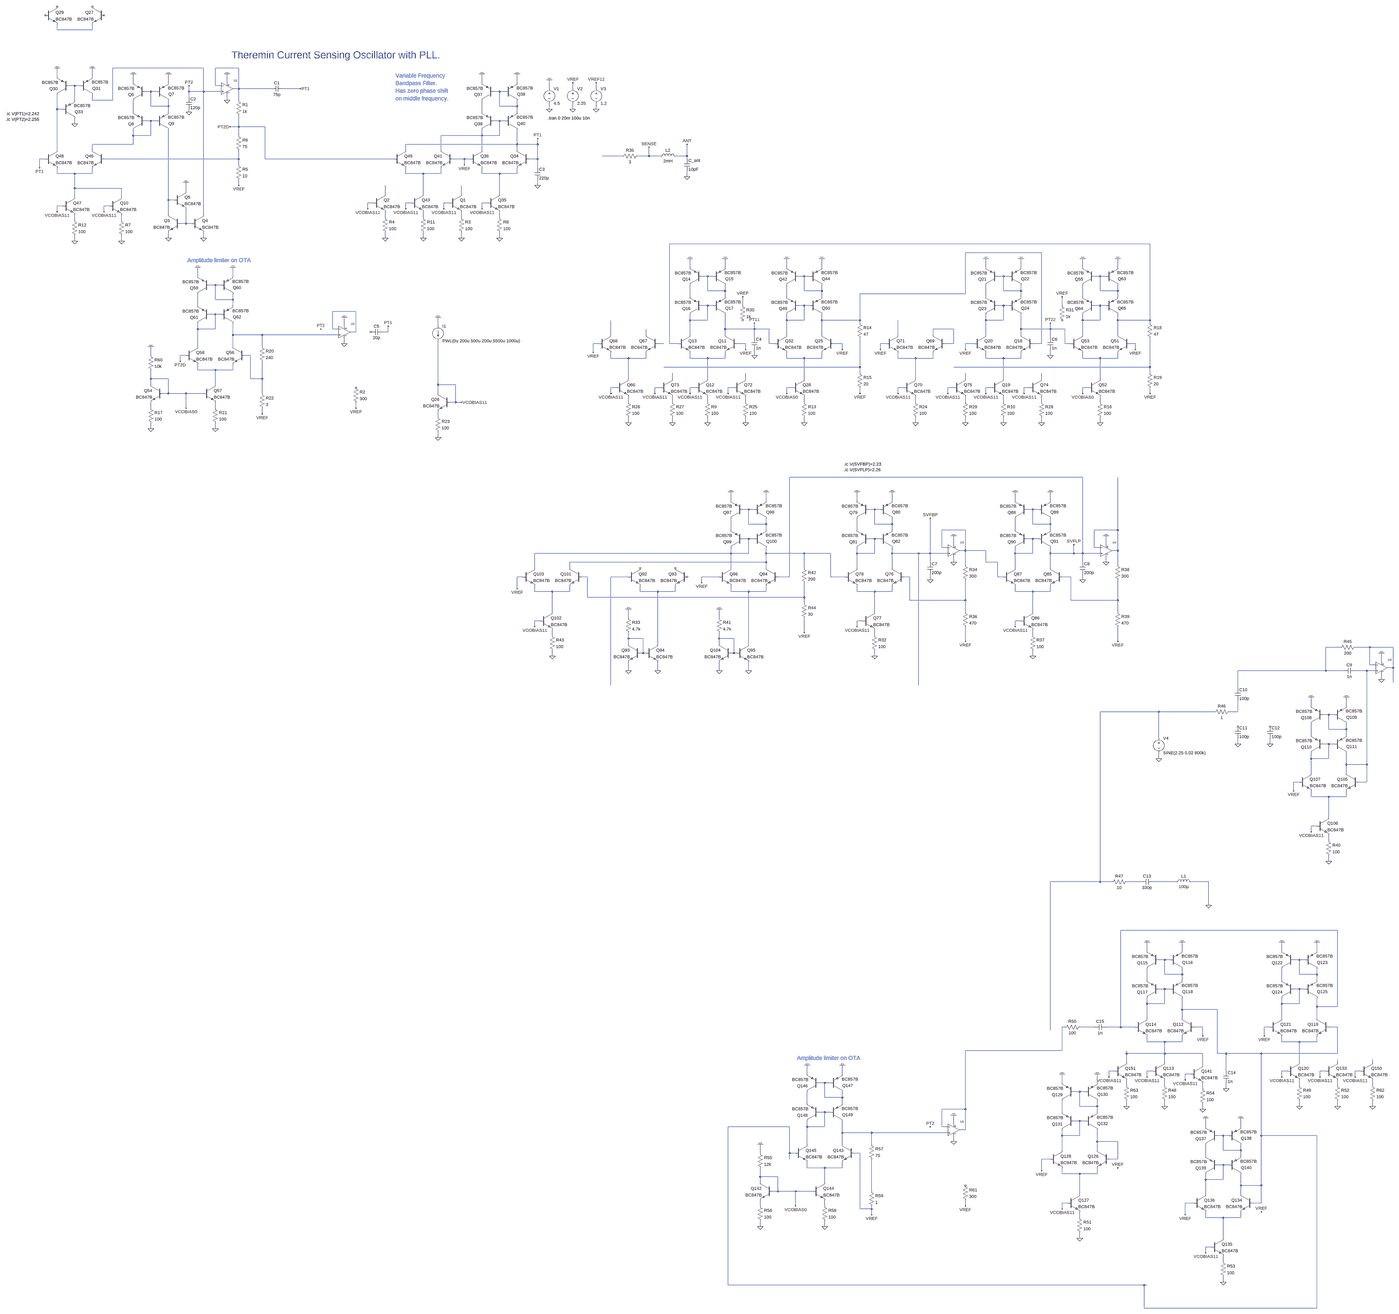
[diagram p0: schematic vco_and_lc_drive_v07.asc, whole sheet]
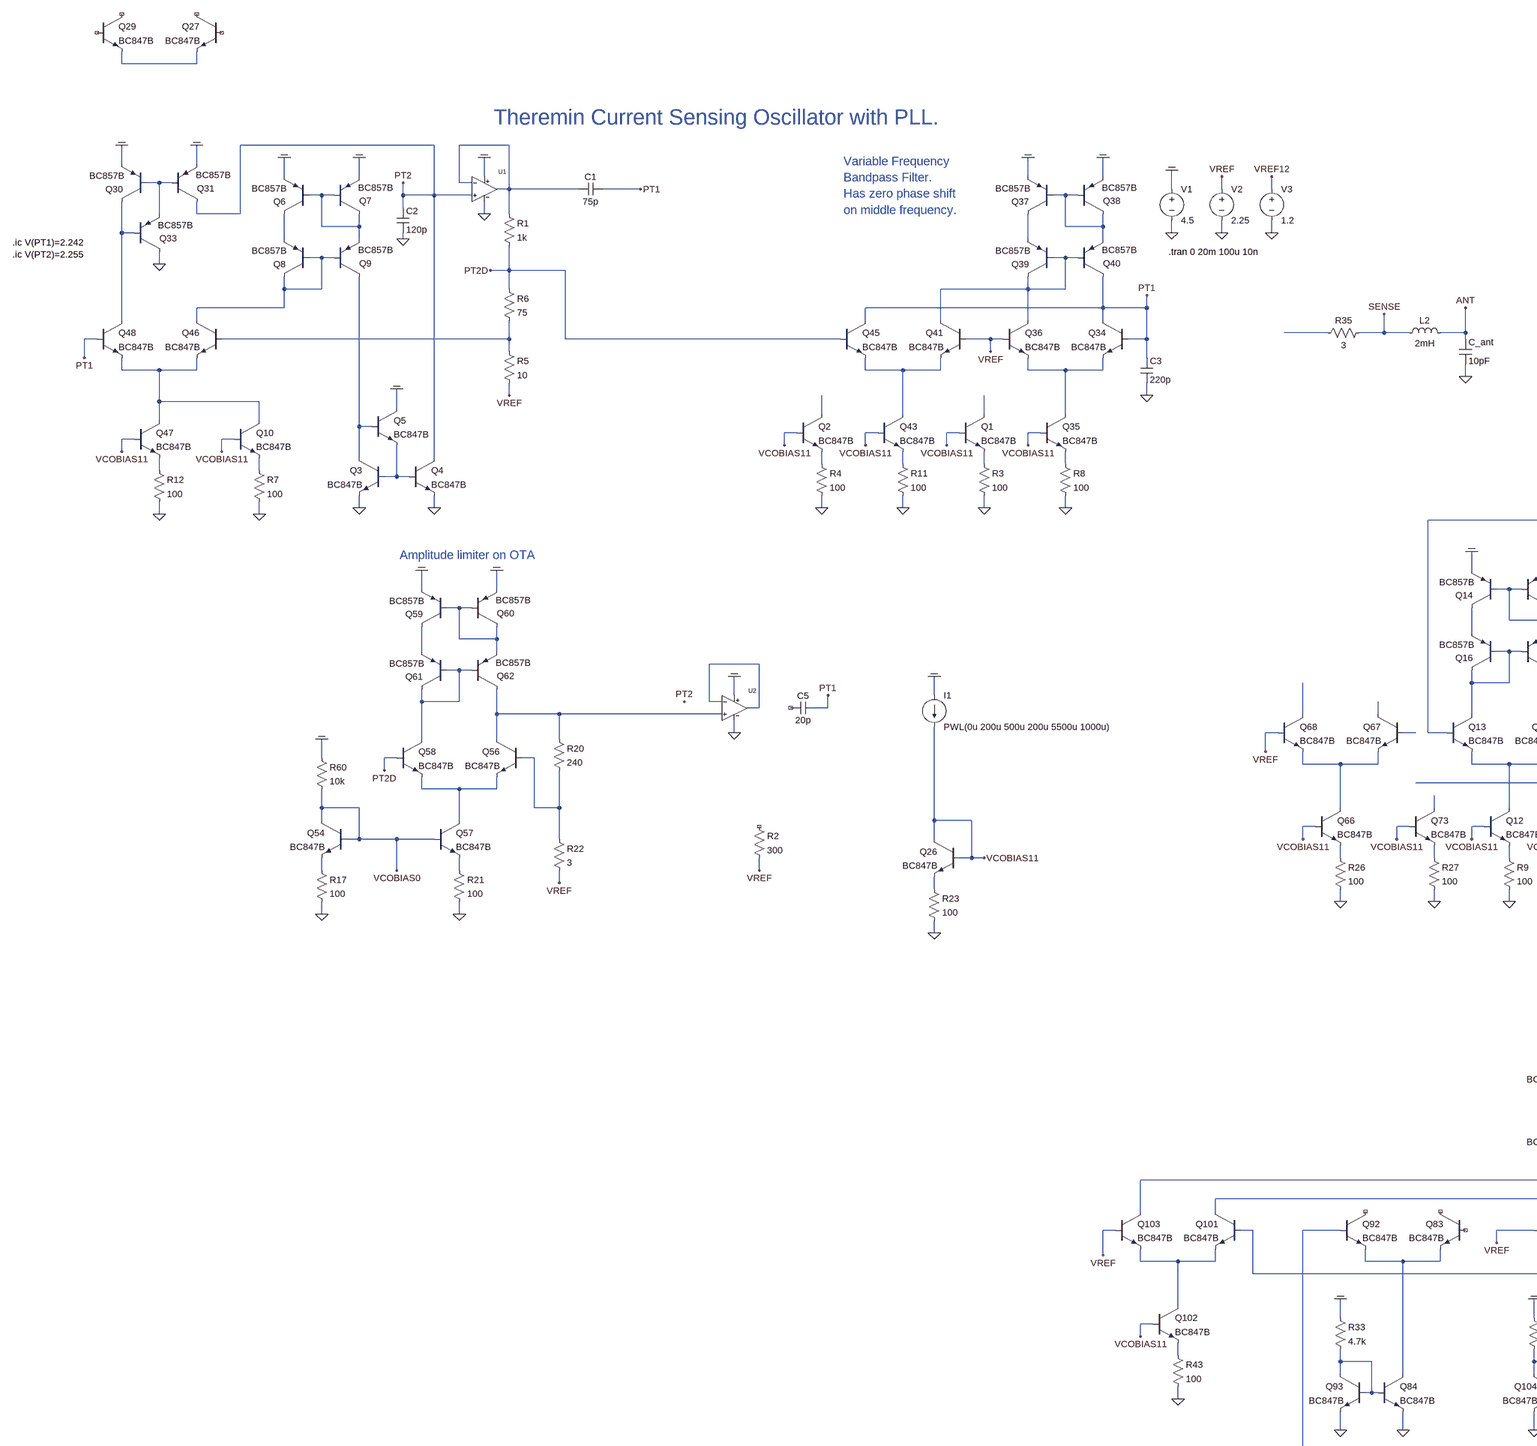
[diagram p1: schematic vco_and_lc_drive_v07.asc, part, row 1 of 2, column 1 of 2]
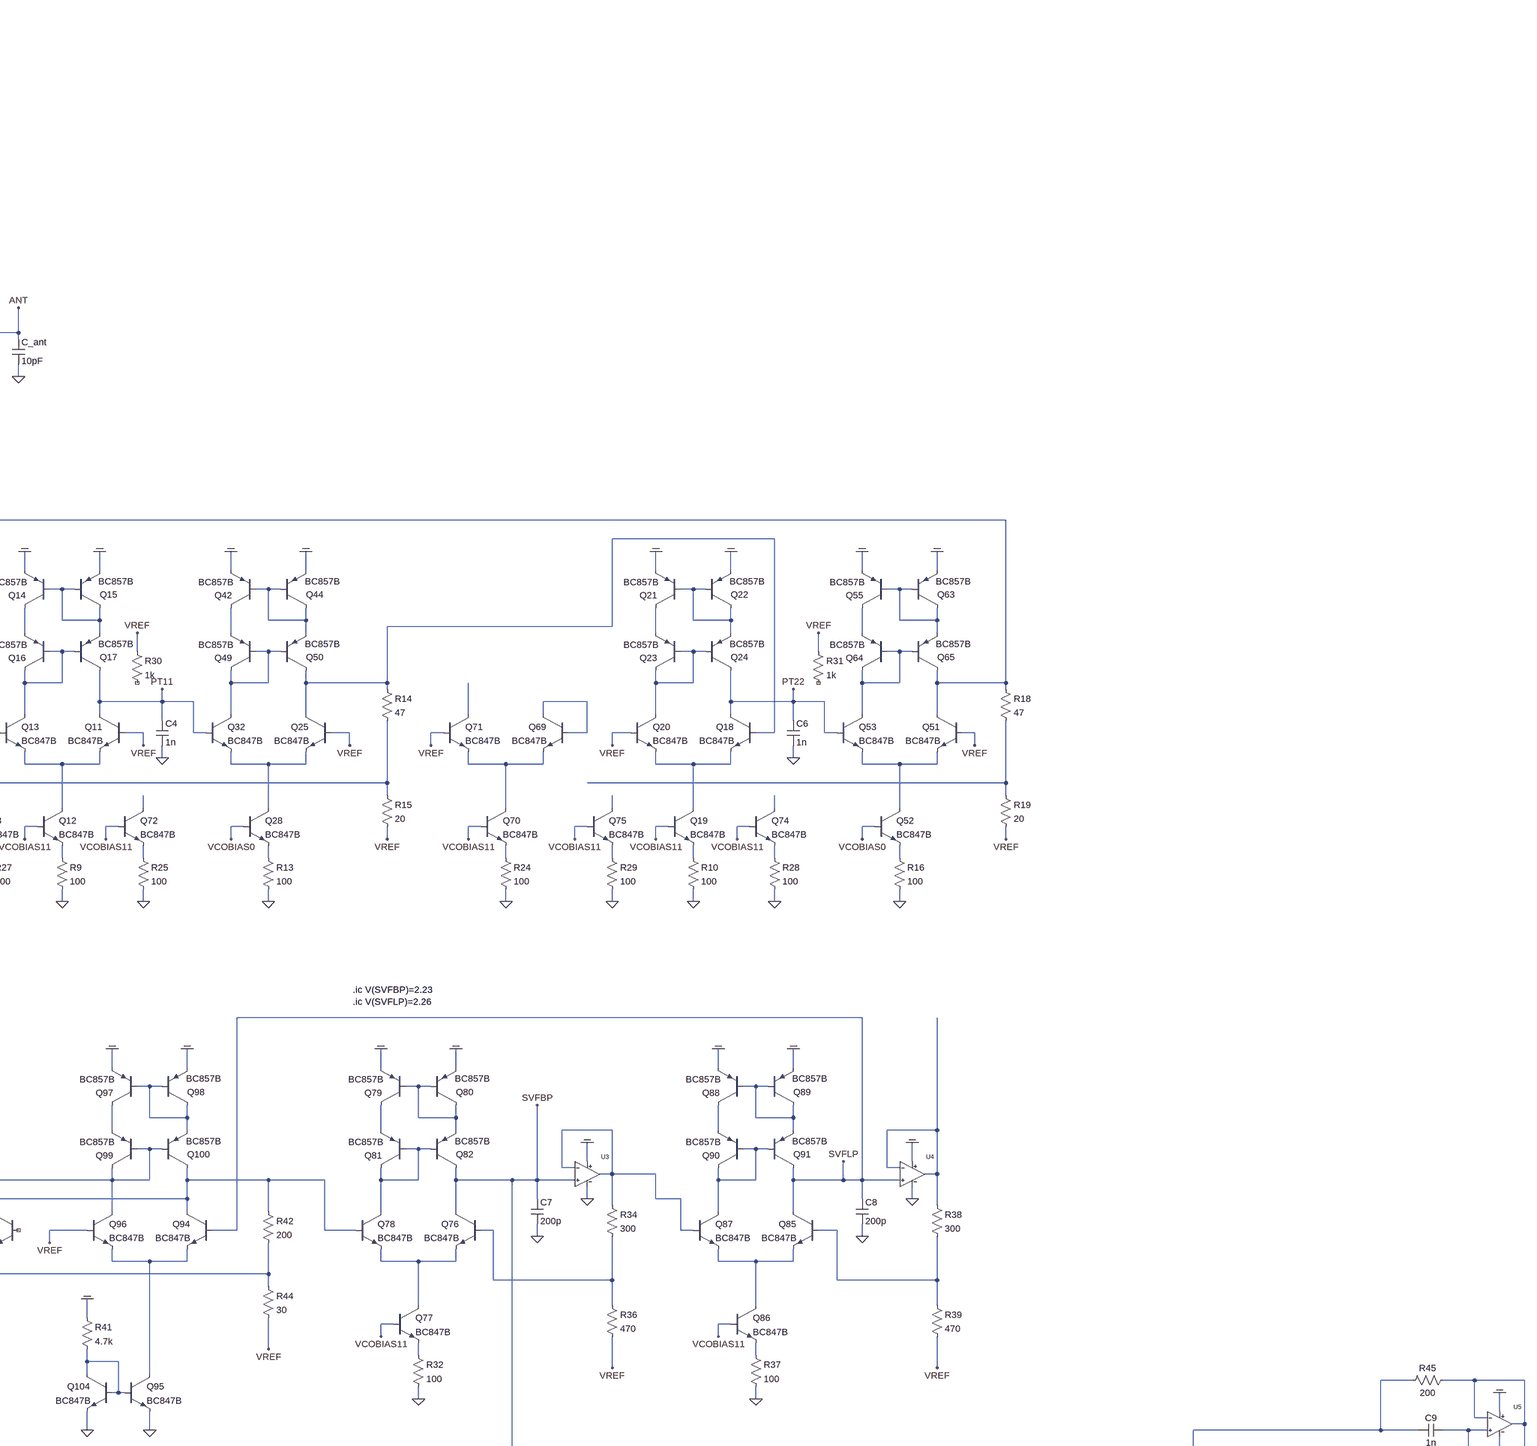
[diagram p2: schematic vco_and_lc_drive_v07.asc, part, row 1 of 2, column 2 of 2]
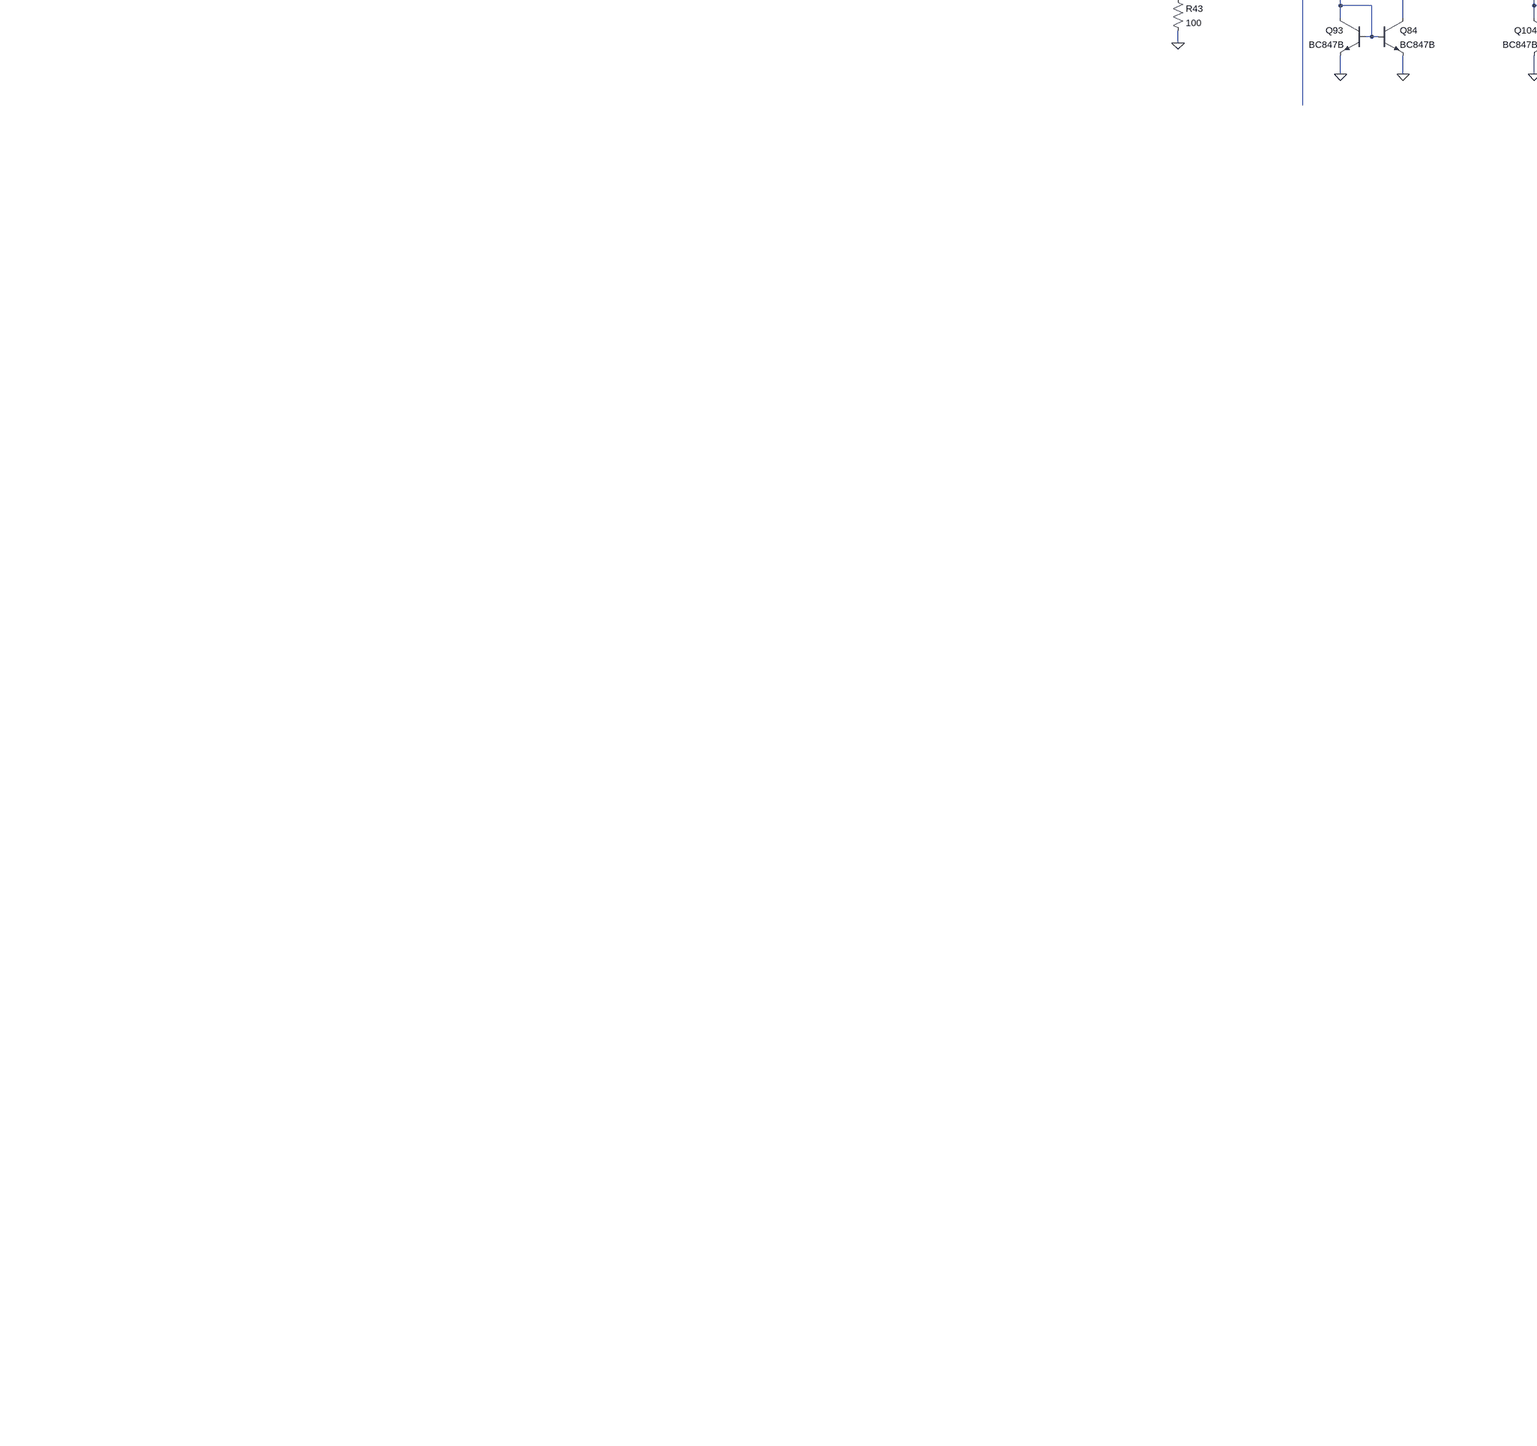
[diagram p3: schematic vco_and_lc_drive_v07.asc, part, row 2 of 2, column 1 of 2]
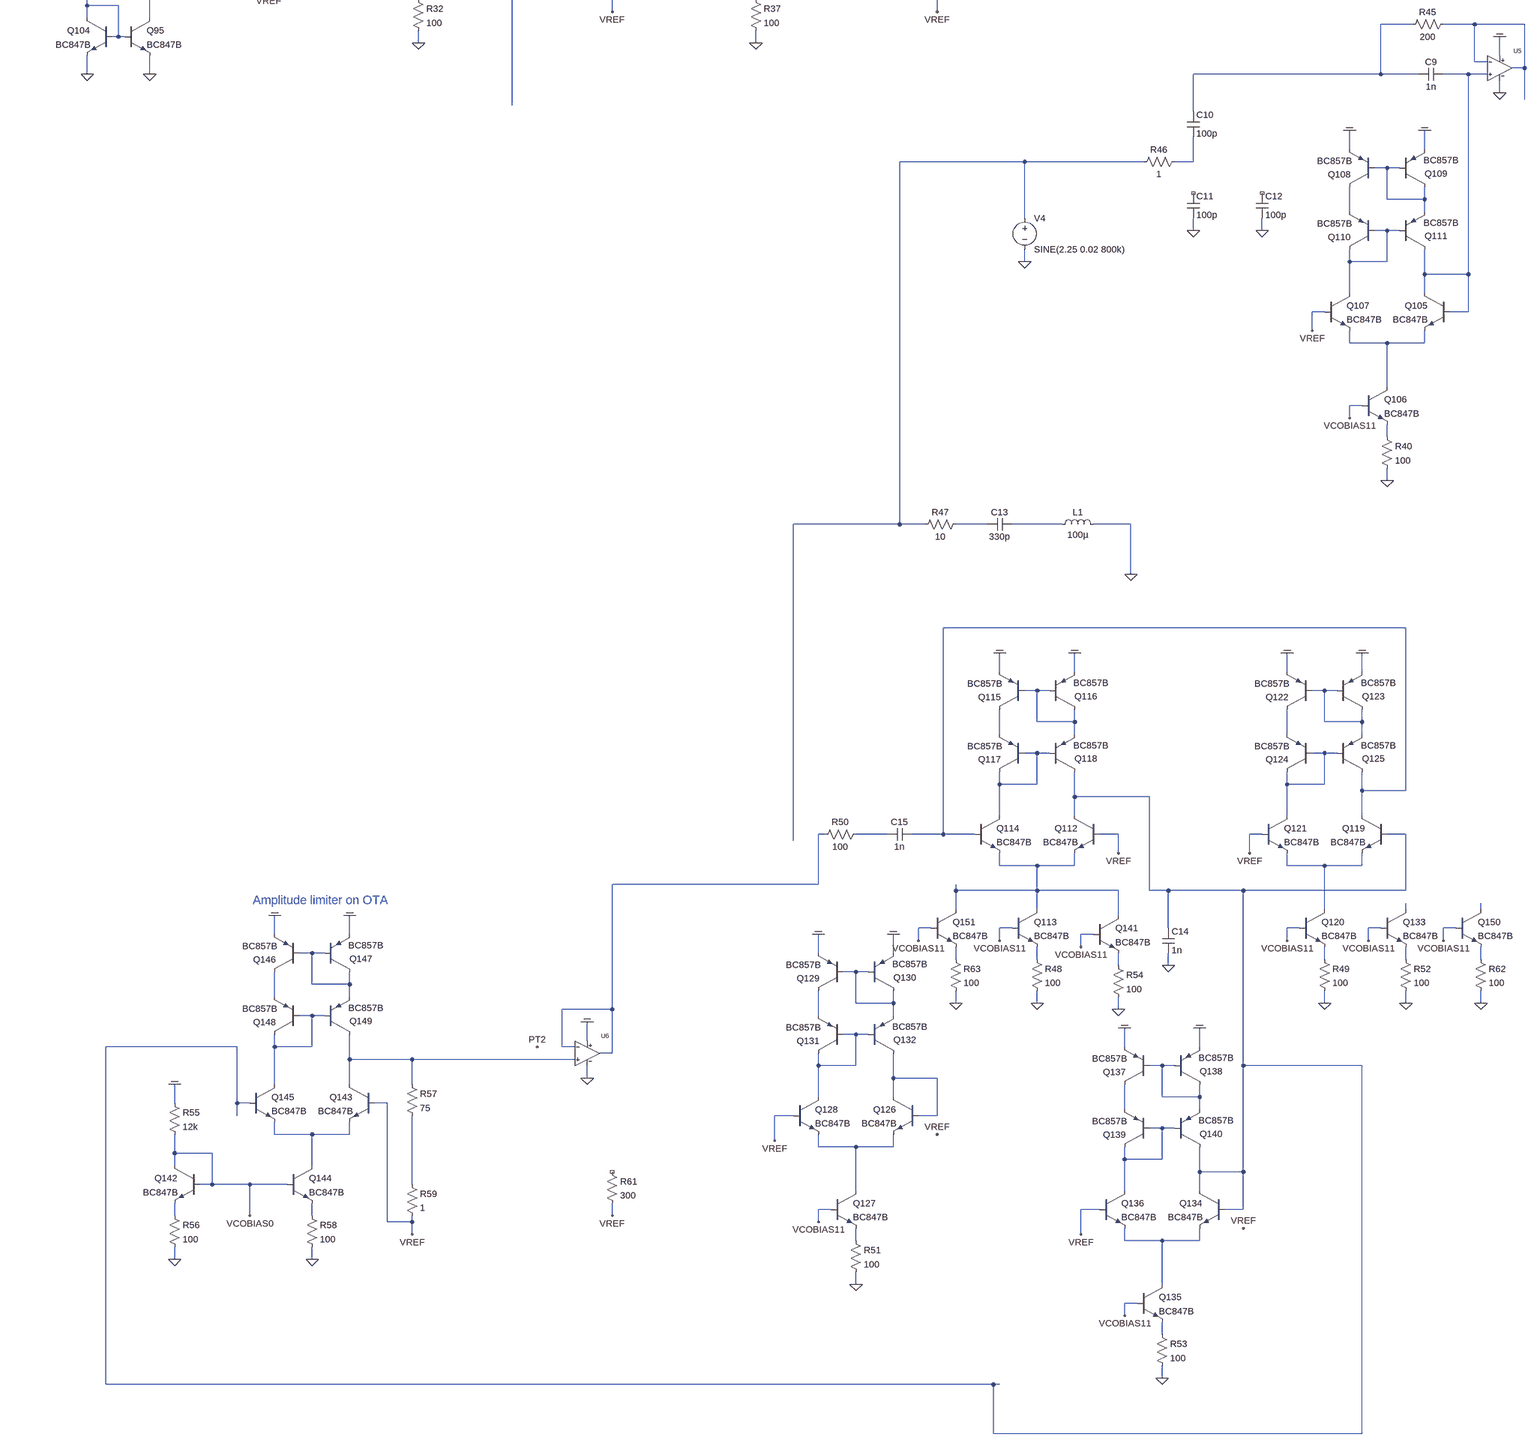
[diagram p4: schematic vco_and_lc_drive_v07.asc, part, row 2 of 2, column 2 of 2]
* vco_and_lc_drive_v07.asc
V1 COM 0 4.5
V2 VREF 0 2.25
R60 COM VCOBIAS0 10k
Q54 VCOBIAS0 VCOBIAS0 N074 0 BC847B
R17 N074 0 100
Q27 NC_01 NC_02 N001 0 BC847B
Q29 NC_03 NC_04 N001 0 BC847B
Q30 N006 N003 COM 0 BC857B
Q31 PT2 N003 COM 0 BC857B
Q33 0 N006 N003 0 BC857B
Q34 PT1 PT1 N015 0 BC847B
Q35 N015 VCOBIAS11 N022 0 BC847B
Q36 N010 VREF N015 0 BC847B
R8 N022 0 100
Q37 N008 N005 COM 0 BC857B
Q38 N005 N005 COM 0 BC857B
Q39 N010 N010 N008 0 BC857B
Q40 PT1 N010 N005 0 BC857B
C2 PT2 0 120p
C5 PT1 NC_05 20p
Q41 N010 VREF N014 0 BC847B
Q43 N014 VCOBIAS11 N020 0 BC847B
Q45 PT1 PT2D N014 0 BC847B
R11 N020 0 100
Q46 N009 N012 N013 0 BC847B
Q47 N013 VCOBIAS11 N023 0 BC847B
Q48 N006 PT1 N013 0 BC847B
R12 N023 0 100
Q56 N045 N050 N059 0 BC847B
Q57 N059 VCOBIAS0 N075 0 BC847B
Q58 N043 PT2D N059 0 BC847B
R20 N045 N050 240
R21 N075 0 100
R22 N050 VREF 3
Q59 N037 N032 COM 0 BC857B
Q60 N032 N032 COM 0 BC857B
Q61 N043 N043 N037 0 BC857B
Q62 N045 N043 N032 0 BC857B
XU2 N045 N042 COM 0 N042 MCP6021  ; pins In+ In- V+ V- OUT
L2 SENSE ANT 2mH Rser=120 Cpar=1pF
C_ant ANT 0 10pF
R35 N011 SENSE 3
V3 VREF12 0 1.2
C3 PT1 0 220p
Q26 VCOBIAS11 VCOBIAS11 N076 0 BC847B
R23 N076 0 100
I1 COM VCOBIAS11 PWL(0u 200u 500u 200u 5500u 1000u)
R2 NC_06 VREF 300
Q1 N017 VCOBIAS11 N021 0 BC847B
R3 N021 0 100
Q2 N016 VCOBIAS11 N019 0 BC847B
R4 N019 0 100
XU1 PT2 N002 COM 0 N002 MCP6021  ; pins In+ In- V+ V- OUT
R1 N002 PT2D 1k
R5 N012 VREF 10
R6 PT2D N012 75
Q3 N018 N025 0 0 BC847B
Q4 PT2 N025 0 0 BC847B
Q5 COM N018 N025 0 BC847B
Q6 N007 N004 COM 0 BC857B
Q7 N004 N004 COM 0 BC857B
Q8 N009 N009 N007 0 BC857B
Q9 N018 N009 N004 0 BC857B
C1 PT1 N002 75p
Q10 N013 VCOBIAS11 N024 0 BC847B
R7 N024 0 100
Q11 PT11 VREF N052 0 BC847B
Q12 N052 VCOBIAS11 N066 0 BC847B
Q13 N038 N026 N052 0 BC847B
R9 N066 0 100
Q14 N033 N028 COM 0 BC857B
Q15 N028 N028 COM 0 BC857B
Q16 N038 N038 N033 0 BC857B
Q17 PT11 N038 N028 0 BC857B
C4 PT11 0 1n
Q25 N027 VREF N053 0 BC847B
Q28 N053 VCOBIAS0 N068 0 BC847B
Q32 N039 PT11 N053 0 BC847B
R13 N068 0 100
Q42 N034 N029 COM 0 BC857B
Q44 N029 N029 COM 0 BC857B
Q49 N039 N039 N034 0 BC857B
Q50 N027 N039 N029 0 BC857B
R14 N027 N057 47
R15 N057 VREF 20
Q18 PT22 N027 N055 0 BC847B
Q19 N055 VCOBIAS11 N071 0 BC847B
Q20 N040 VREF N055 0 BC847B
R10 N071 0 100
Q21 N035 N030 COM 0 BC857B
Q22 N030 N030 COM 0 BC857B
Q23 N040 N040 N035 0 BC857B
Q24 PT22 N040 N030 0 BC857B
C6 PT22 0 1n
Q51 N026 VREF N056 0 BC847B
Q52 N056 VCOBIAS0 N073 0 BC847B
Q53 N041 PT22 N056 0 BC847B
R16 N073 0 100
Q55 N036 N031 COM 0 BC857B
Q63 N031 N031 COM 0 BC857B
Q64 N041 N041 N036 0 BC857B
Q65 N026 N041 N031 0 BC857B
R18 N026 N058 47
R19 N058 VREF 20
Q66 N051 VCOBIAS11 N064 0 BC847B
R26 N064 0 100
Q67 N047 N049 N051 0 BC847B
Q68 N046 VREF N051 0 BC847B
Q69 N044 N044 N054 0 BC847B
Q70 N054 VCOBIAS11 N069 0 BC847B
Q71 N048 VREF N054 0 BC847B
R24 N069 0 100
Q72 N061 VCOBIAS11 N067 0 BC847B
R25 N067 0 100
Q73 N060 VCOBIAS11 N065 0 BC847B
R27 N065 0 100
Q74 N063 VCOBIAS11 N072 0 BC847B
R28 N072 0 100
Q75 N062 VCOBIAS11 N070 0 BC847B
R29 N070 0 100
R30 VREF NC_07 1k
R31 VREF NC_08 1k
Q76 SVFBP N091 N096 0 BC847B
Q77 N096 VCOBIAS11 N099 0 BC847B
Q78 N086 N088 N096 0 BC847B
R32 N099 0 100
Q79 N081 N078 COM 0 BC857B
Q80 N078 N078 COM 0 BC857B
Q81 N086 N086 N081 0 BC857B
Q82 SVFBP N086 N078 0 BC857B
C7 SVFBP 0 200p
Q85 SVFLP N092 N097 0 BC847B
Q86 N097 VCOBIAS11 N100 0 BC847B
Q87 N087 N082 N097 0 BC847B
R37 N100 0 100
Q88 N083 N079 COM 0 BC857B
Q89 N079 N079 COM 0 BC857B
Q90 N087 N087 N083 0 BC857B
Q91 SVFLP N087 N079 0 BC857B
C8 SVFLP 0 200p
Q94 N088 SVFLP N095 0 BC847B
Q95 N095 N102 0 0 BC847B
Q96 N085 VREF N095 0 BC847B
Q97 N080 N077 COM 0 BC857B
Q98 N077 N077 COM 0 BC857B
Q99 N085 N085 N080 0 BC857B
Q100 N088 N085 N077 0 BC857B
R42 N088 N089 200
Q101 N088 N089 N093 0 BC847B
Q103 N085 VREF N093 0 BC847B
Q104 N102 N102 0 0 BC847B
R41 COM N102 4.7k
Q102 N093 VCOBIAS11 N098 0 BC847B
R43 N098 0 100
R44 N089 VREF 30
Q83 NC_09 NC_10 N094 0 BC847B
Q84 N094 N101 0 0 BC847B
Q92 NC_11 N090 N094 0 BC847B
Q93 N101 N101 0 0 BC847B
R33 COM N101 4.7k
XU3 SVFBP N082 COM 0 N082 MCP6021  ; pins In+ In- V+ V- OUT
R34 N082 N091 300
R36 N091 VREF 470
XU4 SVFLP N084 COM 0 N084 MCP6021  ; pins In+ In- V+ V- OUT
R38 N084 N092 300
R39 N092 VREF 470
XU5 N105 N104 COM 0 N104 MCP6021  ; pins In+ In- V+ V- OUT
Q105 N105 N105 N111 0 BC847B
Q106 N111 VCOBIAS11 N112 0 BC847B
Q107 N110 VREF N111 0 BC847B
R40 N112 0 100
Q108 N109 N108 COM 0 BC857B
Q109 N108 N108 COM 0 BC857B
Q110 N110 N110 N109 0 BC857B
Q111 N105 N110 N108 0 BC857B
C9 N105 N103 1n
R45 N104 N103 200
C10 N103 N107 100p
C11 NC_12 0 100p
R46 N107 N106 1
V4 N106 0 SINE(2.25 0.02 800k)
C12 NC_13 0 100p
L1 N114 0 100µ Rser=120
C13 N114 N113 330p
R47 N113 N106 10
Q112 N122 VREF N125 0 BC847B
Q113 N125 VCOBIAS11 N131 0 BC847B
Q114 N120 N115 N125 0 BC847B
R48 N131 0 100
Q115 N118 N116 COM 0 BC857B
Q116 N116 N116 COM 0 BC857B
Q117 N120 N120 N118 0 BC857B
Q118 N122 N120 N116 0 BC857B
Q119 N115 N122 N126 0 BC847B
Q120 N126 VCOBIAS11 N132 0 BC847B
Q121 N121 VREF N126 0 BC847B
R49 N132 0 100
Q122 N119 N117 COM 0 BC857B
Q123 N117 N117 COM 0 BC857B
Q124 N121 N121 N119 0 BC857B
Q125 N115 N121 N117 0 BC857B
C14 N122 0 1n
C15 N115 N124 1n
R50 N124 N123 100
Q126 N143 N143 N147 0 BC847B
Q127 N147 VCOBIAS11 N151 0 BC847B
Q128 N140 VREF N147 0 BC847B
R51 N151 0 100
Q129 N139 N136 COM 0 BC857B
Q130 N136 N136 COM 0 BC857B
Q131 N140 N140 N139 0 BC857B
Q132 N143 N140 N136 0 BC857B
Q133 N127 VCOBIAS11 N133 0 BC847B
R52 N133 0 100
Q134 N122 N122 N152 0 BC847B
Q135 N152 VCOBIAS11 N153 0 BC847B
Q136 N145 VREF N152 0 BC847B
R53 N153 0 100
Q137 N144 N142 COM 0 BC857B
Q138 N142 N142 COM 0 BC857B
Q139 N145 N145 N144 0 BC857B
Q140 N122 N145 N142 0 BC857B
Q141 N125 VCOBIAS11 N135 0 BC847B
R54 N135 0 100
R55 COM VCOBIAS0 12k
Q142 VCOBIAS0 VCOBIAS0 N149 0 BC847B
R56 N149 0 100
Q143 N141 VREF N146 0 BC847B
Q144 N146 VCOBIAS0 N150 0 BC847B
Q145 N138 N122 N146 0 BC847B
R57 N141 N148 75
R58 N150 0 100
R59 N148 VREF 1
Q146 N137 N129 COM 0 BC857B
Q147 N129 N129 COM 0 BC857B
Q148 N138 N138 N137 0 BC857B
Q149 N141 N138 N129 0 BC857B
XU6 N141 N123 COM 0 N123 MCP6021  ; pins In+ In- V+ V- OUT
R61 NC_14 VREF 300
Q150 N128 VCOBIAS11 N134 0 BC847B
R62 N134 0 100
Q151 N125 VCOBIAS11 N130 0 BC847B
R63 N130 0 100
.model NPN NPN
.model PNP PNP
.lib standard.bjt
.tran 0 20m 100u 10n
* Theremin Current Sensing Oscillator with PLL.
.ic V(PT1)=2.242
.ic V(PT2)=2.255
* Amplitude limiter on OTA
* Variable Frequency
* Bandpass Filter.
* Has zero phase shift
* on middle frequency.
.ic V(SVFBP)=2.23
.ic V(SVFLP)=2.26
* Amplitude limiter on OTA
.lib MCP6021.cir
.backanno
.end